# EAGLE schematic Group_08_alternative (EAGLE 9.6.2)
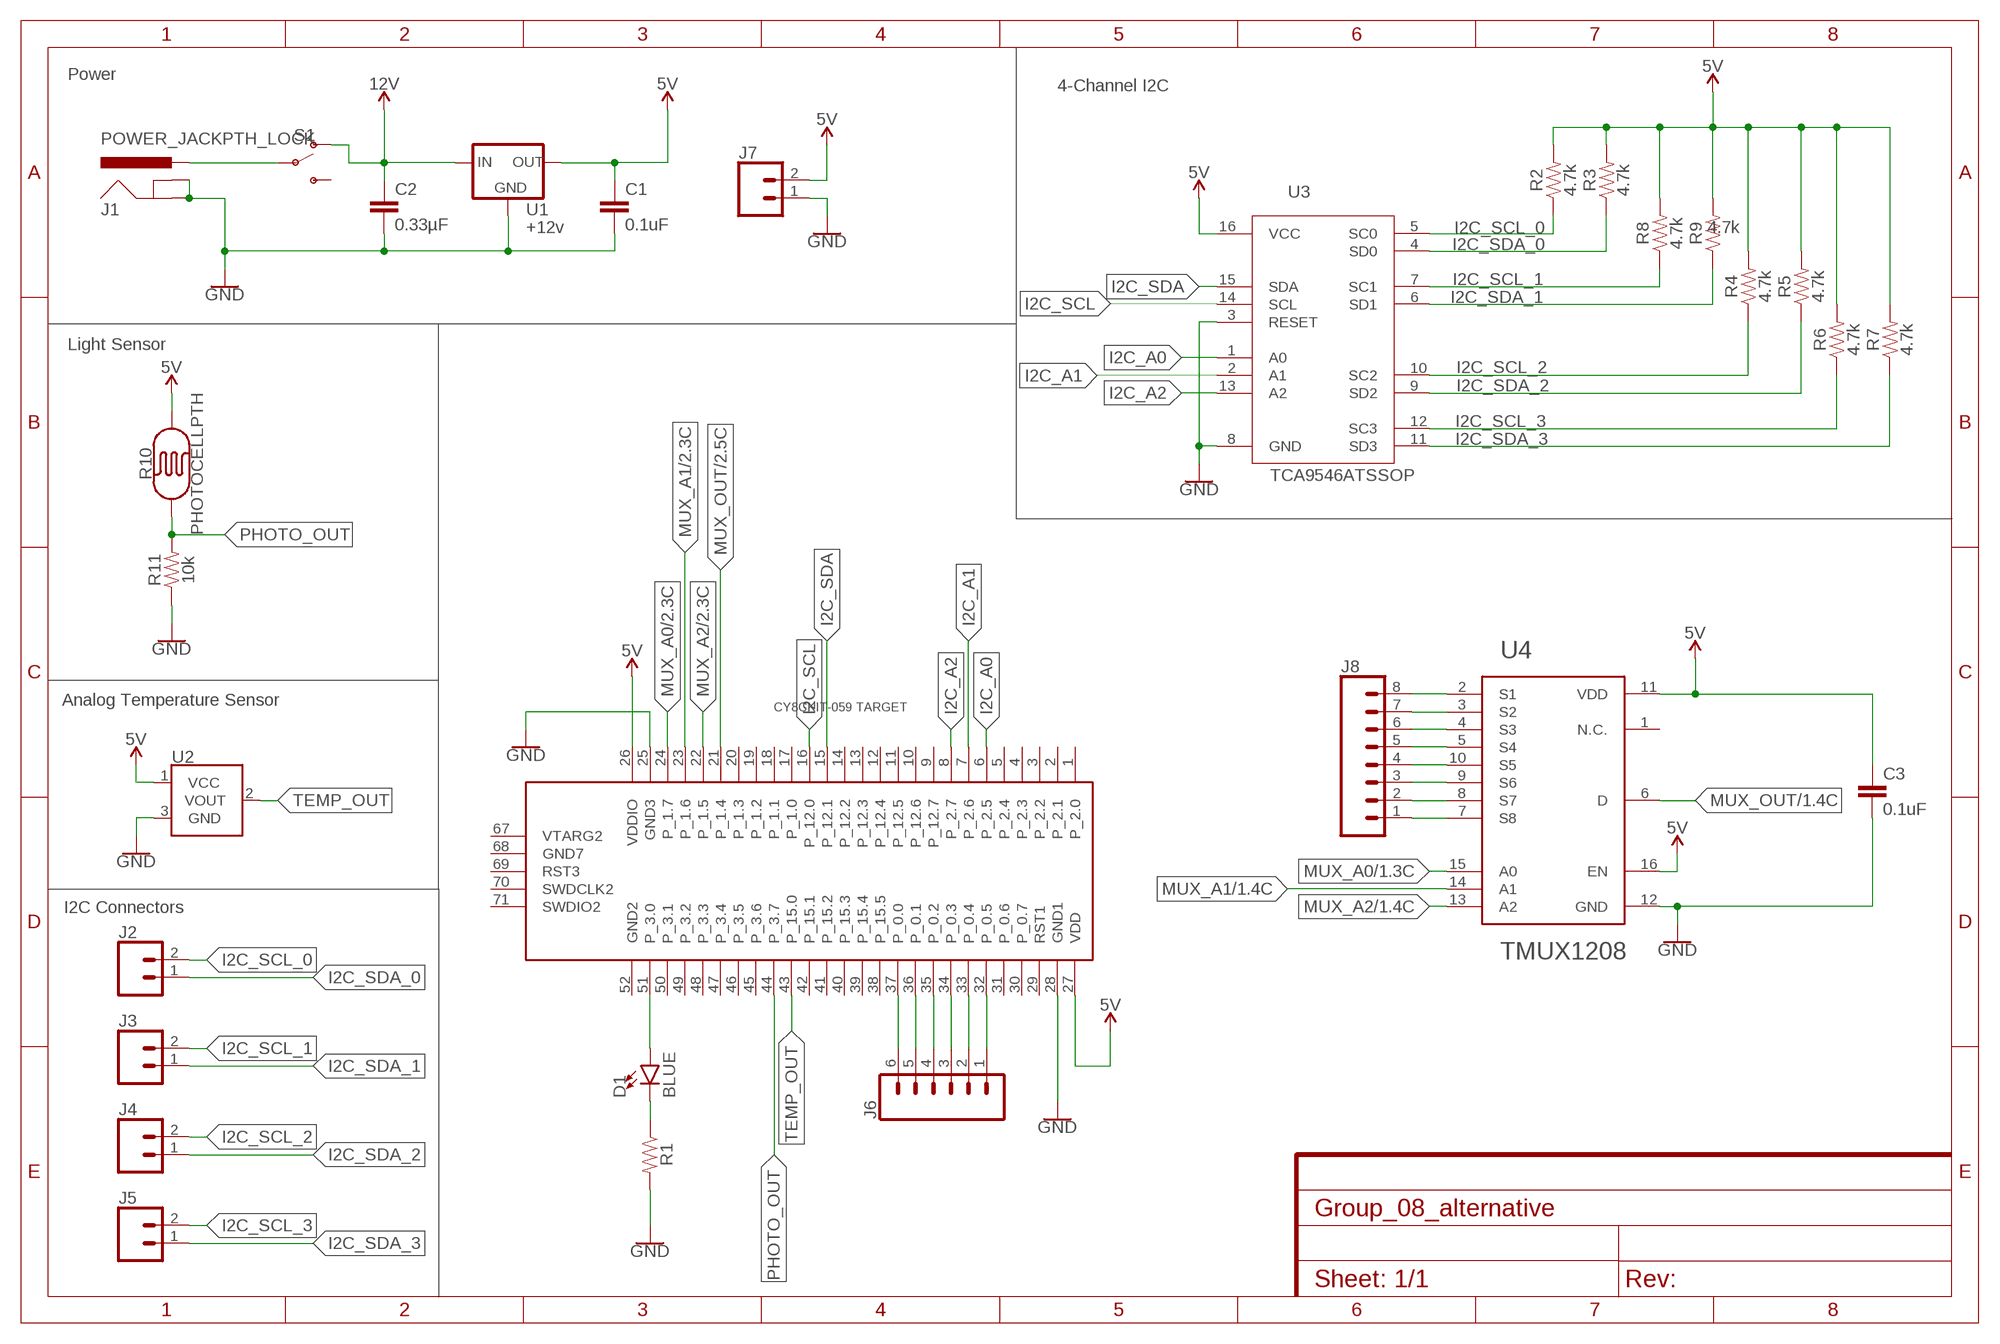
[diagram p0: schematic, sheet 1]

## Parts
C1  0.1uF  0.1UF-KIT-EZ-50V-20%  [CAP-PTH-SMALL-KIT]
C2  0.33µF  0.33UF/330NF-0805-50V-10%  [0805]
C3  0.1uF  0.1UF-KIT-EZ-50V-20%  [CAP-PTH-SMALL-KIT]
CY8CKIT059-TARGET  CY8CKIT-059_TARGET  [CY8CKIT-059_TARGET]
D1  BLUE  LED-BLUE1206  [LED-1206]
J1  POWER_JACKPTH_LOCK  [POWER_JACK_PTH_LOCK]
J2  CONN_02  [1X02]
J3  CONN_02  [1X02]
J4  CONN_02  [1X02]
J5  CONN_02  [1X02]
J6  CONN_06LOCK  [1X06_LOCK]
J7  CONN_02  [1X02]
J8  CONN_08LOCK  [1X08_LOCK]
R1  RESISTORAXIAL-0.3  [AXIAL-0.3]
R2  4.7k  4.7KOHM-0603-1/10W-1%  [0603]
R3  4.7k  4.7KOHM-0603-1/10W-1%  [0603]
R4  4.7k  4.7KOHM-0603-1/10W-1%  [0603]
R5  4.7k  4.7KOHM-0603-1/10W-1%  [0603]
R6  4.7k  4.7KOHM-0603-1/10W-1%  [0603]
R7  4.7k  4.7KOHM-0603-1/10W-1%  [0603]
R8  4.7k  4.7KOHM-0603-1/10W-1%  [0603]
R9  4.7k  4.7KOHM-0603-1/10W-1%  [0603]
R10  PHOTOCELLPTH  [PHOTOCELL]
R11  10k  10KOHM-0603-1/10W-1%  [0603]
S1  SWITCH-SPDT-PTH-11.6X4.0MM  [SWITCH_SPDT_PTH_11.6X4.0MM]
U1  +12v  V_REG_78XX7812  [TO-252]
U2  TMP36GT9  [TO-92]
U3  TCA9546ATSSOP  [TSSOP16]
U4  TMUX1208  [QFN16]

## Nets
5V: C1.1 C3.1 CY8CKIT059-TARGET.26(VDDIO) CY8CKIT059-TARGET.27(VDD) J7.2 R2.2 R3.2 R4.2 R5.2 R6.2 R7.2 R8.2 R9.2 R10.2 U1.2(OUT) U2.1(VCC) U3.16(VCC) U4.11(VDD) U4.16(EN)
12V: C2.1 S1.1(O) U1.1(IN)
GND: C1.2 C2.2 C3.2 CY8CKIT059-TARGET.25(GND3) CY8CKIT059-TARGET.28(GND1) J1.GND J1.GNDBREAK J7.1 R1.P$2 R11.1 U1.3(GND) U2.3(GND) U3.3(RESET) U3.8(GND) U4.12(GND)
I2C_A0: CY8CKIT059-TARGET.6(P_2.5) U3.1(A0)
I2C_A1: CY8CKIT059-TARGET.7(P_2.6) U3.2(A1)
I2C_A2: CY8CKIT059-TARGET.8(P_2.7) U3.13(A2)
I2C_SCL: CY8CKIT059-TARGET.16(P_12.0) U3.14(SCL)
I2C_SCL_0: J2.2 R2.1 U3.5(SC0)
I2C_SCL_1: J3.2 R8.1 U3.7(SC1)
I2C_SCL_2: J4.2 R4.1 U3.10(SC2)
I2C_SCL_3: J5.2 R6.1 U3.12(SC3)
I2C_SDA: CY8CKIT059-TARGET.15(P_12.1) U3.15(SDA)
I2C_SDA_0: J2.1 R3.1 U3.4(SD0)
I2C_SDA_1: J3.1 R9.1 U3.6(SD1)
I2C_SDA_2: J4.1 R5.1 U3.9(SD2)
I2C_SDA_3: J5.1 R7.1 U3.11(SD3)
MUX_A0/1.3C: U4.15(A0)
MUX_A0/2.3C: CY8CKIT059-TARGET.24(P_1.7)
MUX_A1/1.4C: U4.14(A1)
MUX_A1/2.3C: CY8CKIT059-TARGET.23(P_1.6)
MUX_A2/1.4C: U4.13(A2)
MUX_A2/2.3C: CY8CKIT059-TARGET.22(P_1.5)
MUX_OUT/1.4C: U4.6(D)
MUX_OUT/2.5C: CY8CKIT059-TARGET.21(P_1.4)
N$2: J1.PWR S1.2(P)
N$10: J8.1 U4.7(S8)
N$11: J8.2 U4.8(S7)
N$12: J8.3 U4.9(S6)
N$13: J8.4 U4.10(S5)
N$14: J8.5 U4.5(S4)
N$16: J8.6 U4.4(S3)
N$17: J8.7 U4.3(S2)
N$18: J8.8 U4.2(S1)
N$19: CY8CKIT059-TARGET.37(P_0.0) J6.6
N$20: CY8CKIT059-TARGET.32(P_0.5) J6.1
N$21: CY8CKIT059-TARGET.33(P_0.4) J6.2
N$22: CY8CKIT059-TARGET.34(P_0.3) J6.3
N$23: CY8CKIT059-TARGET.35(P_0.2) J6.4
N$24: CY8CKIT059-TARGET.36(P_0.1) J6.5
N$25: D1.C R1.P$1
N$26: CY8CKIT059-TARGET.51(P_3.0) D1.A
PHOTO_OUT: CY8CKIT059-TARGET.44(P_3.7) R10.1 R11.2
TEMP_OUT: CY8CKIT059-TARGET.43(P_15.0) U2.2(VOUT)
Unconnected: CY8CKIT059-TARGET.1(P_2.0) CY8CKIT059-TARGET.2(P_2.1) CY8CKIT059-TARGET.3(P_2.2) CY8CKIT059-TARGET.4(P_2.3) CY8CKIT059-TARGET.5(P_2.4) CY8CKIT059-TARGET.9(P_12.7) CY8CKIT059-TARGET.10(P_12.6) CY8CKIT059-TARGET.11(P_12.5) CY8CKIT059-TARGET.12(P_12.4) CY8CKIT059-TARGET.13(P_12.3) CY8CKIT059-TARGET.14(P_12.2) CY8CKIT059-TARGET.17(P_1.0) CY8CKIT059-TARGET.18(P_1.1) CY8CKIT059-TARGET.19(P_1.2) CY8CKIT059-TARGET.20(P_1.3) CY8CKIT059-TARGET.29(RST1) CY8CKIT059-TARGET.30(P_0.7) CY8CKIT059-TARGET.31(P_0.6) CY8CKIT059-TARGET.38(P_15.5) CY8CKIT059-TARGET.39(P_15.4) CY8CKIT059-TARGET.40(P_15.3) CY8CKIT059-TARGET.41(P_15.2) CY8CKIT059-TARGET.42(P_15.1) CY8CKIT059-TARGET.45(P_3.6) CY8CKIT059-TARGET.46(P_3.5) CY8CKIT059-TARGET.47(P_3.4) CY8CKIT059-TARGET.48(P_3.3) CY8CKIT059-TARGET.49(P_3.2) CY8CKIT059-TARGET.50(P_3.1) CY8CKIT059-TARGET.52(GND2) CY8CKIT059-TARGET.67(VTARG2) CY8CKIT059-TARGET.68(GND7) CY8CKIT059-TARGET.69(RST3) CY8CKIT059-TARGET.70(SWDCLK2) CY8CKIT059-TARGET.71(SWDIO2) S1.3(S) U4.1(N.C.)

## Notes on the sheet
- Power
- 4-Channel I2C
- Light Sensor
- Analog Temperature Sensor
- I2C Connectors

## Library data of the parts
C1 C3 = SparkFun-Capacitors:0.1UF: 0.1µF ceramic capacitors A capacitor is a passive two-terminal electrical component used to store electrical energy temporarily in an electric field.; PROD_ID: CAP-08370
C2 = SparkFun-Capacitors:0.33UF/330NF: 0.33µF/330nF ceramic capacitors A capacitor is a passive two-terminal electrical component used to store electrical energy temporarily in an electric field.; PROD_ID: CAP-08469
CY8CKIT059-TARGET = CY8KIT-059:CY8CKIT-059_TARGET: CY8CKIT-059 Target This device exposes the pins of the target section of the CY8CKIT-059, including the programming section, that must be connected to the KitProg in order to program the target micro-controller.
D1 = SparkFun-LED:LED-BLUE: Blue SMD LED Used in manufacturing of various products at SparkFun Packages: 0603 - SMD 0603 package [Product Link] <http://www.digikey.com/product-detail/en/SMLE12BC7TT86/511-1589-2-ND/1641808> 1206 - SMD1206 package [Product Link] <http://www.digikey.com/product-detail/en/lite-on-inc/LTST-C150TBKT/160-1643-1-ND/573584> SparkFun Products: ESP8266 Thing-Dev Board <https://www.sparkfun.com/products/13711> RedBoard <https://www.sparkfun.com/products/12757>; PROD_ID: DIO-09911
J1 = SparkFun-Connectors:POWER_JACK: Power Jack Connector This is the standard 5.5mm barrel jack for power. The PTH is the most common, proven, reliable, footprint. The Slot footprint only works if the mill layer is transmitted to the PCB fab house so be warned. Here are the connectors we sell at SparkFun: DC Barrel Power Jack/Connector <https://www.sparkfun.com/products/119> (PRT-00119) DC Barrel Power Jack/Connector (SMD) <https://www.sparkfun.com/products/12748> (PRT-12748) DC Barrel Jack Adapter - Breadboard Compatible <https://www.sparkfun.com/products/10811> (PRT-10811) It is used on this SparkFun product (and many, many others): SparkFun RedBoard - Programmed with Arduino <https://www.sparkfun.com/products/12757> (DEV-12757) Also, if you need a mating power supply or connector, please check these out: Wall Adapter Power Supply - 9VDC 650mA <https://www.sparkfun.com/products/298> (TOL-00298) DC Barrel Jack Adapter - Male <https://www.sparkfun.com/products/10287> (PRT-10287); PROD_ID: CONN-08197; SF_ID: PRT-00119
J2-J5 J7 = SparkFun-Connectors:CONN_02: Multi connection point. Often used as Generic Header-pin footprint for 0.1 inch spaced/style header connections On any of the 0.1 inch spaced packages, you can populate with these: Break Away Headers - Straight <https://www.sparkfun.com/products/116> (PRT-00116) Break Away Male Headers - Right Angle <https://www.sparkfun.com/products/553> (PRT-00553) Female Headers <https://www.sparkfun.com/products/115> (PRT-00115) Break Away Headers - Machine Pin <https://www.sparkfun.com/products/117> (PRT-00117) Break Away Female Headers - Swiss Machine Pin <https://www.sparkfun.com/products/743> (PRT-00743) For SCREWTERMINALS and SPRING TERMINALS visit here: Screw Terimnals on SparkFun.com <https://www.sparkfun.com/search/results?term=Screw+Terminals> (5mm/3.5mm/2.54mm spacing) This device is also useful as a general connection point to wire up your design to another part of your project. Our various solder wires solder well into these plated through hole pads. Hook-Up Wire - Assortment (Stranded, 22 AWG) <https://www.sparkfun.com/products/11375> (PRT-11375) Hook-Up Wire - Assortment (Solid Core, 22 AWG) <https://www.sparkfun.com/products/11367> (PRT-11367) View the entire wire category on our website here <https://www.sparkfun.com/categories/141> Special notes: Molex polarized connector foot print use with: PRT-08233 with associated crimp pins and housings. 2.54_SCREWTERM for use with PRT-10571. 3.5mm Screw Terminal footprints for PRT-08084 5mm Screw Terminal footprints for use with PRT-08432
J6 = SparkFun-Connectors:CONN_06: Multi connection point. Often used as Generic Header-pin footprint for 0.1 inch spaced/style header connections On any of the 0.1 inch spaced packages, you can populate with these: Break Away Headers - Straight <https://www.sparkfun.com/products/116> (PRT-00116) Break Away Male Headers - Right Angle <https://www.sparkfun.com/products/553> (PRT-00553) Female Headers <https://www.sparkfun.com/products/115> (PRT-00115) Break Away Headers - Machine Pin <https://www.sparkfun.com/products/117> (PRT-00117) Break Away Female Headers - Swiss Machine Pin <https://www.sparkfun.com/products/743> (PRT-00743) Arduino Stackable Header - 6 Pin <https://www.sparkfun.com/products/9280> (PRT-09280) For SCREWTERMINALS and SPRING TERMINALS visit here: Screw Terimnals on SparkFun.com <https://www.sparkfun.com/search/results?term=Screw+Terminals> (5mm/3.5mm/2.54mm spacing) This device is also useful as a general connection point to wire up your design to another part of your project. Our various solder wires solder well into these plated through hole pads. Hook-Up Wire - Assortment (Stranded, 22 AWG) <https://www.sparkfun.com/products/11375> (PRT-11375) Hook-Up Wire - Assortment (Solid Core, 22 AWG) <https://www.sparkfun.com/products/11367> (PRT-11367) View the entire wire category on our website here <https://www.sparkfun.com/categories/141>
J8 = SparkFun-Connectors:CONN_08: Multi connection point. Often used as Generic Header-pin footprint for 0.1 inch spaced/style header connections On any of the 0.1 inch spaced packages, you can populate with these: Break Away Headers - Straight <https://www.sparkfun.com/products/116> (PRT-00116) Break Away Male Headers - Right Angle <https://www.sparkfun.com/products/553> (PRT-00553) Female Headers <https://www.sparkfun.com/products/115> (PRT-00115) Break Away Headers - Machine Pin <https://www.sparkfun.com/products/117> (PRT-00117) Break Away Female Headers - Swiss Machine Pin <https://www.sparkfun.com/products/743> (PRT-00743) Arduino Stackable Header - 8 Pin <https://www.sparkfun.com/products/9279> (PRT-09279) For SCREWTERMINALS and SPRING TERMINALS visit here: Screw Terimnals on SparkFun.com <https://www.sparkfun.com/search/results?term=Screw+Terminals> (5mm/3.5mm/2.54mm spacing) This device is also useful as a general connection point to wire up your design to another part of your project. Our various solder wires solder well into these plated through hole pads. Hook-Up Wire - Assortment (Stranded, 22 AWG) <https://www.sparkfun.com/products/11375> (PRT-11375) Hook-Up Wire - Assortment (Solid Core, 22 AWG) <https://www.sparkfun.com/products/11367> (PRT-11367) View the entire wire category on our website here <https://www.sparkfun.com/categories/141> Special notes: Molex polarized connector foot print use with SKU : PRT-08231 with associated crimp pins and housings. 1MM SMD Version SKU: PRT-10208 NOTES ON THE VARIANTS LOCK and LOCK_LONGPADS... This footprint was designed to help hold the alignment of a through-hole component (i.e. 6-pin header) while soldering it into place. You may notice that each hole has been shifted either up or down by 0.005 of an inch from it's more standard position (which is a perfectly straight line). This slight alteration caused the pins (the squares in the middle) to touch the edges of the holes. Because they are alternating, it causes a "brace" to hold the component in place. 0.005 has proven to be the perfect amount of "off-center" position when using our standard breakaway headers. Although looks a little odd when you look at the bare footprint, once you have a header in there, the alteration is very hard to notice. Also,if you push a header all the way into place, it is covered up entirely on the bottom side.
R1 = SparkFun-Resistors:RESISTOR: Generic Resistor Package
R2-R9 = SparkFun-Resistors:4.7KOHM: 4.7kΩ resistor A resistor is a passive two-terminal electrical component that implements electrical resistance as a circuit element. Resistors act to reduce current flow, and, at the same time, act to lower voltage levels within circuits. - Wikipedia; PROD_ID: RES-07857
R10 = SparkFun-Sensors:PHOTOCELL: Photocell (Photodetector, Photo Resistor, CdS) This is a very small light sensor. A photocell changes (also called a photodetector, photo resistor, CdS or photoconductive cell) resistance depending on the amount of light it is exposed to. These little sensors make great ambient light triggers (when light in the room turns on, do something). Datasheet <http://cdn.sparkfun.com/datasheets/Sensors/LightImaging/SEN-09088.pdf> SparkFun Products Mini Photocell <https://www.sparkfun.com/products/9088> (SEN-09088); PROD_ID: COMP-09129; SF_ID: SEN-09088
R11 = SparkFun-Resistors:10KOHM: 10kΩ resistor A resistor is a passive two-terminal electrical component that implements electrical resistance as a circuit element. Resistors act to reduce current flow, and, at the same time, act to lower voltage levels within circuits. - Wikipedia; PROD_ID: RES-00824
S1 = SparkFun-Switches:SWITCH-SPDT: Single Pole, Double Throw (SPDT) Switch Single-pole, double-throw (SPDT) switch. Variant Overview SMD-AYZ0202 Surface Mount DPDT Switch <https://www.sparkfun.com/products/597> (COM-00597) Used on e.g. LilyPad Arduino USB - ATmega32U4 Board <https://www.sparkfun.com/products/12049> PTH-11.6X4.0MM SPDT Mini Power Switch <https://www.sparkfun.com/products/102> (COM-00102) Used on e.g. SparkFun Simon Says - Through-Hole Soldering Kit <https://www.sparkfun.com/products/10547> (KIT-10547) PTH-11.6X4.0MM-KIT KIT version of SPDT Mini Power Switch - Simplifies soldering by removing tStop of switch pins - only one side can be soldered. PTH-11.6X4.0MM-LOCK LOCK version of SPDT Mini Power Switch - Offset pins hold switch in place for easier soldering. SMD-RIGHT-ANGLE Surface Mount Right Angle Switch <https://www.sparkfun.com/products/10860> (COM-10860) Used on e.g. SparkFun ESP8266 Thing <https://www.sparkfun.com/products/13231>; PROD_ID: SWCH-08261; SF_SKU: COM-00102
U1 = SparkFun-IC-Power:V_REG_78XX: Voltage Regulator Standard 78xx regulator. IGO (Input Ground Output). Spark Fun Electronics SKU : COM-00107; PROD_ID: VREG-12370
U2 = SparkFun-Sensors:TMP36: TMP36 Precision Analog °C Temperature Sensor The TMP36 is a low voltage, precision centigrade temperature sensor. It provides a voltage output that is linearly proportional to the Celsius temperature. It also doesn’t require any external calibration to provide typical accuracies of ±1°C at +25°C and ±2°C over the −40°C to +125°C temperature range. We like it because it’s so easy to use: Just give the device a ground and 2.7 to 5.5 VDC and read the voltage on the Vout pin. The output voltage can be converted to temperature easily using the scale factor of 10 mV/°C. Datasheet <http://cdn.sparkfun.com/datasheets/Sensors/Temp/TMP35_36_37.pdf> SparkFun Products Temperature Sensor - TMP36 <https://www.sparkfun.com/products/10988> (SEN-10988) SparkFun Danger Shield <https://www.sparkfun.com/products/11649> (DEV-11649); PROD_ID: IC-09880; SF_ID: SEN-10988
U3 = Group_08_Library:TCA9546A: The TCA9546A is a quad bidirectional translating switch controlled via the I2C bus. The SCL/SDA upstream pair fans out to four downstream pairs, or channels. Any individual SCn/SDn channel or combination of channels can be selected, determined by the contents of the programmable control register. An active-low reset (RESET) input allows the TCA9546A to recover from a situation in which one of the downstream I 2C buses is stuck in a low state. Pulling RESET low resets the I 2C state machine and causes all the channels to be deselected, as does the internal power-on reset function. The pass gates of the switches are constructed such that the VCC pin can be used to limit the maximum high voltage, which will be passed by the TCA9546A. This allows the use of different bus voltages on each pair, so that 1.8-V, 2.5-V, or 3.3-V parts can communicate with 5-V parts without any additional protection. External pull-up resistors pull the bus up to the desired voltage level for each channel. All I/O pins are 5.5-V tolerant. Features 1-of-4 Bidirectional translating switches I2C Bus and SMBus compatible Active-low reset input Three address pins, allowing up to eight TCA9546A devices on the I 2C bus Channel selection via I 2C Bus, in any combination Power-up with all switch channels deselected Low RON switches Allows voltage-level translation between 1.8-V, 2.5-V, 3.3-V, and 5-V buses No glitch on power-up Supports hot insertion Low standby current Operating power-supply voltage range of 1.65 V to 5.5 V 5.5 V Tolerant inputs 0 to 400-kHz Clock frequency Latch-up performance exceeds 100 mA Per JESD 78 ESD Protection exceeds JESD 22 4000-V Human-body model (A114-A) 1500-V Charged-device model (C101)
U4 = Group_08_Library:TMUX1208: The TMUX1208 is a general purpose complementary metal-oxide semiconductor (CMOS) multiplexer (MUX). The TMUX1208 offers 8:1 singleended channels. Wide operating supply of 1.08 V to 5.5 V allows for use in a broad array of applications from personal electronics to building automation applications. The device supports bidirectional analog and digital signals on the source (Sx) and drain (D) pins ranging from GND to VDD